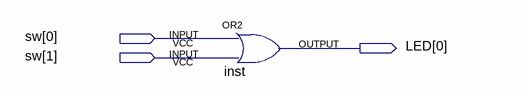
[diagram p0: schematic sheet]
// Quartus schematic Lab_3_ex_1.bdf as structural Verilog: 1 symbols, 3 pins
module Lab_3_ex_1 (
  input  [1:0] sw,
  output [0:0] LED
);

  or inst (LED[0], sw[0], sw[1]);
endmodule
